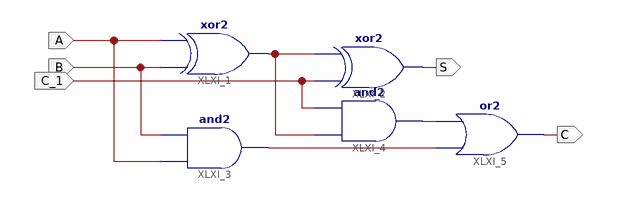
[diagram p0: schematic sheet 1]
// Xilinx ISE schematic Sumador_Completo_2bits.sch (spartan6) as structural Verilog: 5 symbols, 5 ports
module Sumador_Completo_2bits (
  input  C_1,
  input  B,
  input  A,
  output S,
  output C
);

  wire XLXN_1, XLXN_5, XLXN_6;

  xor XLXI_1 (XLXN_5, B, A);
  xor XLXI_2 (S, C_1, XLXN_5);
  and XLXI_3 (XLXN_1, A, B);
  and XLXI_4 (XLXN_6, XLXN_5, C_1);
  or XLXI_5 (C, XLXN_1, XLXN_6);
endmodule
